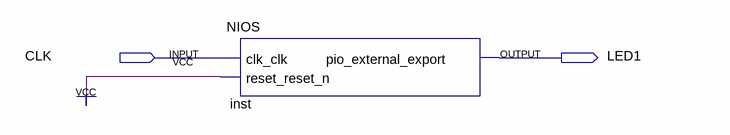
[diagram p0: schematic sheet]
// Quartus schematic fpga_epcq_controller.bdf as structural Verilog: 1 symbols, 2 pins
module fpga_epcq_controller (
  input  CLK,
  output LED1
);

  NIOS inst (.clk_clk(CLK), .reset_reset_n(1'b1), .pio_external_export(LED1));
endmodule
